# EAGLE schematic weichen-a-1 (EAGLE 9.6.2)
AUTHOR: Balazs Racz; DRAWING_TITLE: MEB Schalterwerk Projekt; LICENSE: Licensed by the Solderpad Hardware License V2.0; REVIEWER: n/a; REVISION: A; YEAR: 2023
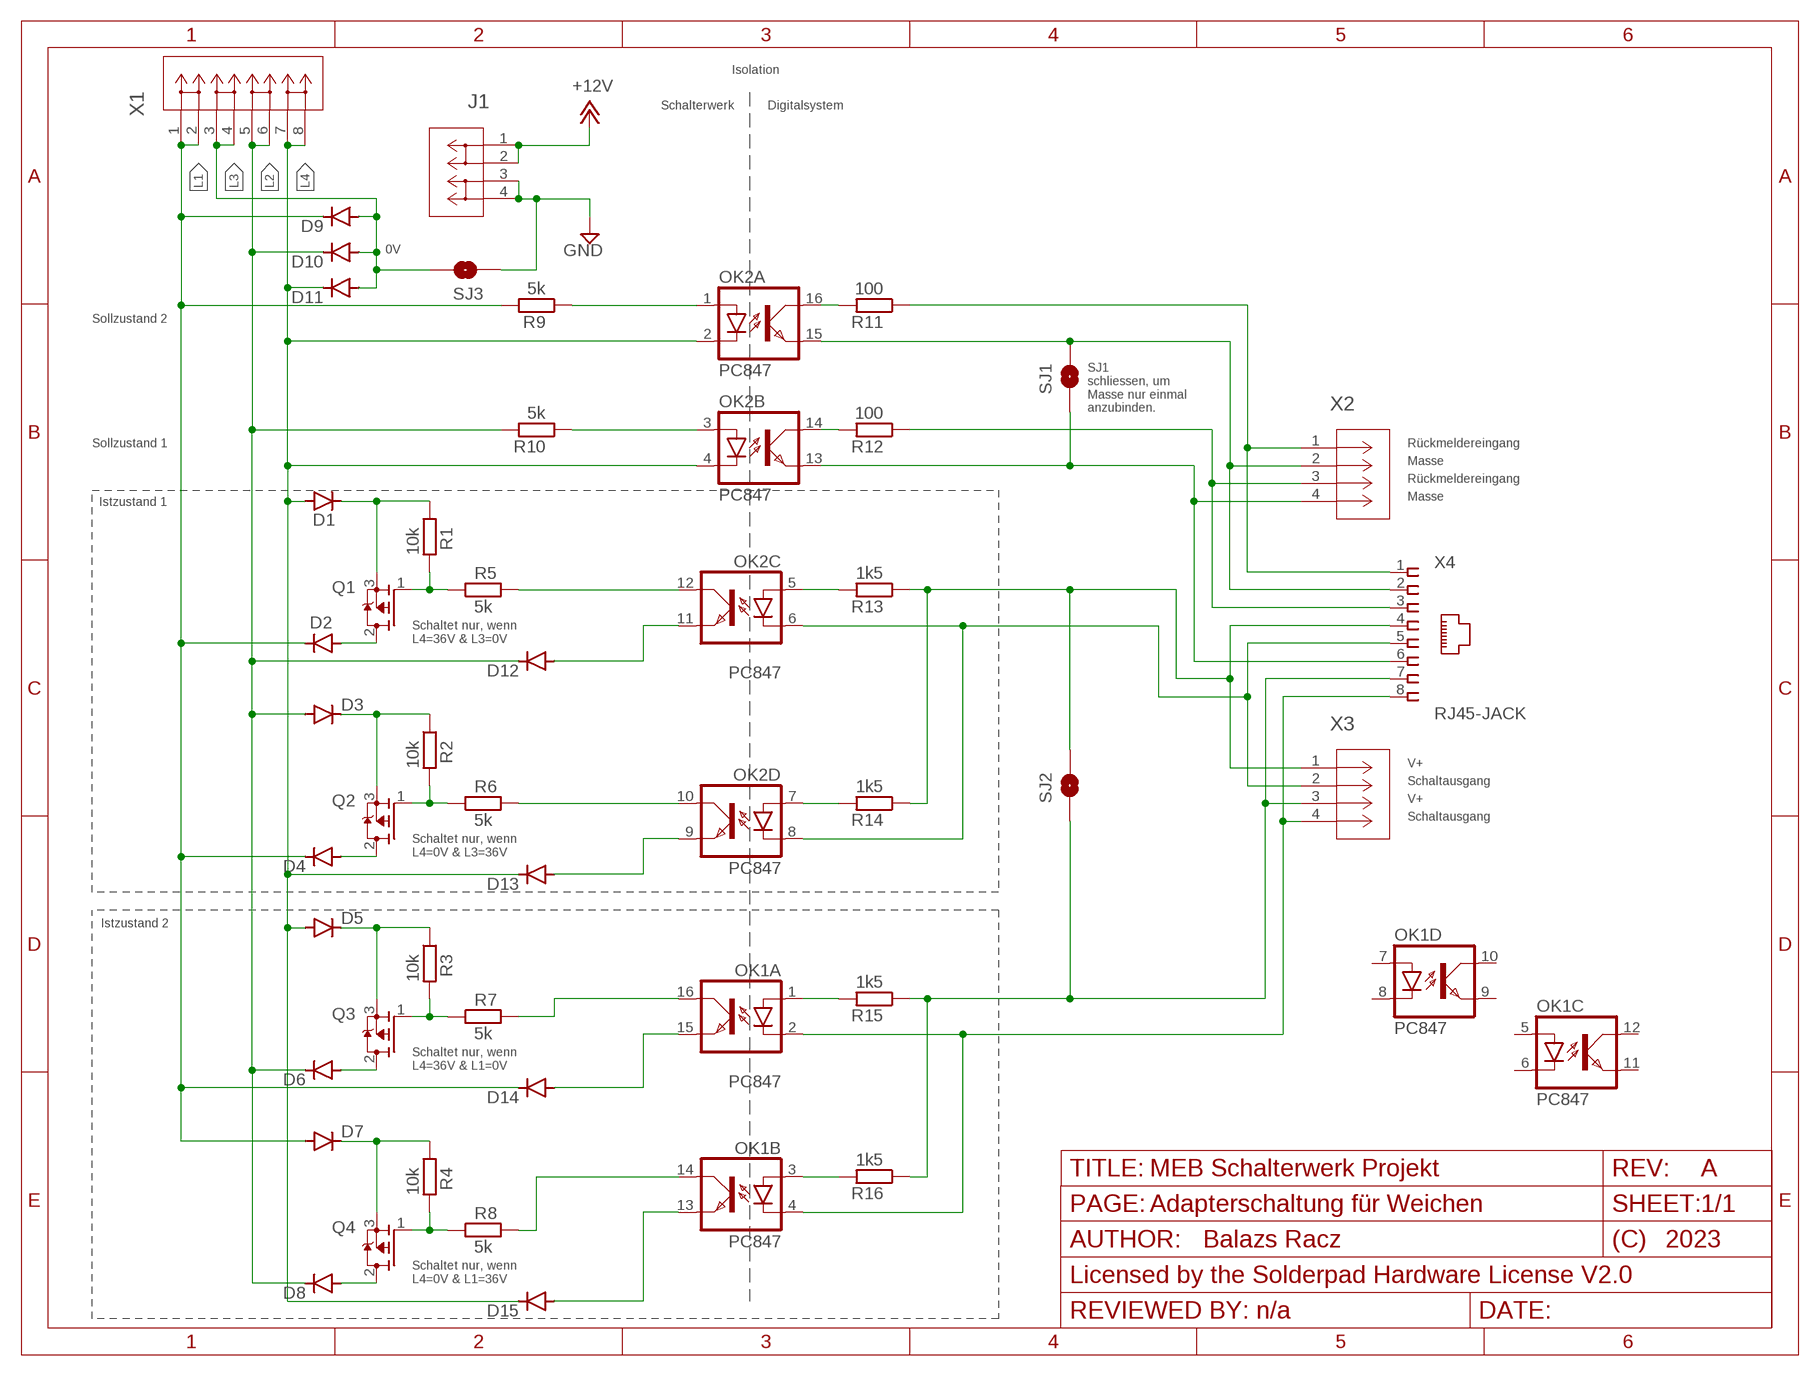
[diagram p0: schematic, sheet 1]
FRAME1 (FRAME_A_L): PAGE: Input ports
FRAME2 (FRAME_A_L): PAGE: Adapterschaltung für Weichen

## Parts
D1  DIODE-DO214AC  [DO214AC]
D2  DIODE-DO214AC  [DO214AC]
D3  DIODE-DO214AC  [DO214AC]
D4  DIODE-DO214AC  [DO214AC]
D5  DIODE-DO214AC  [DO214AC]
D6  DIODE-DO214AC  [DO214AC]
D7  DIODE-DO214AC  [DO214AC]
D8  DIODE-DO214AC  [DO214AC]
D9  DIODE-DO214AC  [DO214AC]
D10  DIODE-DO214AC  [DO214AC]
D11  DIODE-DO214AC  [DO214AC]
D12  DIODE-DO214AC  [DO214AC]
D13  DIODE-DO214AC  [DO214AC]
D14  DIODE-DO214AC  [DO214AC]
D15  DIODE-DO214AC  [DO214AC]
J1  PHNX_2P_508CONN_1017491  [PHNX_2P_508]
OK1  PC847  [DIL16]
OK2  PC847  [DIL16]
Q1  P-MOSFET  [DPAK-2]
Q2  P-MOSFET  [DPAK-2]
Q3  P-MOSFET  [DPAK-2]
Q4  P-MOSFET  [DPAK-2]
R1  10k  R-EU_R0805  [R0805]
R2  10k  R-EU_R0805  [R0805]
R3  10k  R-EU_R0805  [R0805]
R4  10k  R-EU_R0805  [R0805]
R5  5k  R-EU_R0805  [R0805]
R6  5k  R-EU_R0805  [R0805]
R7  5k  R-EU_R0805  [R0805]
R8  5k  R-EU_R0805  [R0805]
R9  5k  R-EU_R0805  [R0805]
R10  5k  R-EU_R0805  [R0805]
R11  100  R-EU_R0805  [R0805]
R12  100  R-EU_R0805  [R0805]
R13  1k5  R-EU_R0805  [R0805]
R14  1k5  R-EU_R0805  [R0805]
R15  1k5  R-EU_R0805  [R0805]
R16  1k5  R-EU_R0805  [R0805]
SJ1  SJRND2  [SJ_RND2]
SJ2  SJRND2  [SJ_RND2]
SJ3  SJRND2  [SJ_RND2]
X1  PHNX_4P_508CONN_1017493  [PHNX_4P_508]
X2  PHNX_4P_350CONN_1984989_PXC  [PHNX_4P_350]
X3  PHNX_4P_350CONN_1984989_PXC  [PHNX_4P_350]
X4  RJ45-JACK  RJ45-JACKRJ45-PULSE-E5J00  [RJ45-PULSE-E5J88]

## Nets
+12V: J1.1 J1.2
GND: J1.3 J1.4 SJ3.P$1
L1: D2.C D4.C D7.A D9.C D14.C R9.2 X1.1 X1.2
L2: D3.A D6.C D8.C D10.C D12.C R10.2 X1.5 X1.6
L3: D9.A D10.A D11.A SJ3.P$2 X1.3 X1.4
L4: D1.A D5.A D11.C D13.C D15.C OK2.2(A:C) OK2.4(B:C) X1.7 X1.8
N$1: D3.C Q2.3(S) R2.1
N$2: OK2.1(A:A) R9.1
N$3: R11.1 X2.1 X4.1
N$4: OK2.15(A:EMIT) SJ1.P$2 X2.2 X4.2
N$5: OK2.5(C:A) R13.2
N$6: R12.1 X2.3 X4.3
N$7: OK2.3(B:A) R10.1
N$8: OK2.7(D:A) R14.2
N$9: Q1.1(G) R1.2 R5.1
N$10: OK2.12(C:COL) R5.2
N$11: OK2.10(D:COL) R6.2
N$12: Q2.1(G) R2.2 R6.1
N$13: D1.C Q1.3(S) R1.1
N$14: OK2.6(C:C) OK2.8(D:C) X3.2 X4.5
N$15: R15.1 R16.1 SJ2.P$1 X3.3 X4.7
N$16: OK1.2(A:C) OK1.4(B:C) X3.4 X4.8
N$17: D12.A OK2.11(C:EMIT)
N$18: D2.A Q1.2(D)
N$19: OK2.16(A:COL) R11.2
N$20: OK2.13(B:EMIT) SJ1.P$1 X2.4 X4.6
N$21: OK2.14(B:COL) R12.2
N$22: D13.A OK2.9(D:EMIT)
N$23: D4.A Q2.2(D)
N$24: OK1.1(A:A) R15.2
N$25: OK1.3(B:A) R16.2
N$26: R13.1 R14.1 SJ2.P$2 X3.1 X4.4
N$27: OK1.16(A:COL) R7.2
N$29: Q3.1(G) R3.2 R7.1
N$30: OK1.14(B:COL) R8.2
N$31: Q4.1(G) R4.2 R8.1
N$33: D7.C Q4.3(S) R4.1
N$34: D5.C Q3.3(S) R3.1
N$35: D14.A OK1.15(A:EMIT)
N$36: D6.A Q3.2(D)
N$37: D15.A OK1.13(B:EMIT)
N$38: D8.A Q4.2(D)
Unconnected: OK1.5(C:A) OK1.6(C:C) OK1.7(D:A) OK1.8(D:C) OK1.9(D:EMIT) OK1.10(D:COL) OK1.11(C:EMIT) OK1.12(C:COL)

## Notes on the sheet
- Isolation
- Schalterwerk | Digitalsystem
- 0V
- Sollzustand 2
- SJ1
  schliessen, um
  Masse nur einmal
  anzubinden.
- Sollzustand 1 | Rückmeldereingang
- Masse
- Rückmeldereingang
- Masse
- Istzustand 1
- Schaltet nur, wenn
  L4=36V & L3=0V
- V+
- Schaltausgang
- V+
- Schaltausgang
- Schaltet nur, wenn
  L4=0V & L3=36V
- Istzustand 2
- Schaltet nur, wenn
  L4=36V & L1=0V
- Schaltet nur, wenn
  L4=0V & L1=36V

## Library data of the parts
D1-D15 = diode:DIODE-: DIODE
J1 = eagleparts:PHNX_2P_508; COPYRIGHT: Copyright (C) 2023 Ultra Librarian. All rights reserved.; MANUFACTURER_PART_NUMBER: 1017503; MFR_NAME: Phoenix Contact
OK1 OK2 = optocoupler:PC847: SHARP OPTO COUPLER; OC_FARNELL: 9707735; OC_NEWARK: unknown
Q1-Q4 = eagleparts:P-MOSFET: RoHS Compliant | Low RDS(on) | Industry-leading quality | Dynamic dv/dt Rating | Fast Switching | Fully Avalanche Rated | 175C Operating Temperature | P-Channel MOSFET; MANUFACTURER: Infineon; MAXIMUM_PACKAGE_HEIGHT: 2.39 mm; PARTREV: 12/14/04; STANDARD: IPC-7351B
R1-R16 = rcl:R-EU_: RESISTOR, European symbol; SPICEPREFIX: R
SJ1-SJ3 = eagleparts:SJ: SMD solder JUMPER
X1 = eagleparts:PHNX_4P_508: https://www.digikey.com/en/products/detail/phoenix-contact/1017505/9346606 DigiKey 277-17516-ND; COPYRIGHT: Copyright (C) 2023 Ultra Librarian. All rights reserved.; MANUFACTURER_PART_NUMBER: 1017505; MFR_NAME: Phoenix Contact
X2 X3 = eagleparts:PHNX_4P_350: https://www.digikey.com/en/products/detail/phoenix-contact/1984989/2513979 DigiKey 277-6404-ND; COPYRIGHT: Copyright (C) 2023 Ultra Librarian. All rights reserved.; MANUFACTURER_PART_NUMBER: 1984989; MFR_NAME: Phoenix Contact
X4 = trainlib:RJ45-JACK: Mod. Jack, Right Angle, 8 posiotion, 8 contatcs RJ45 Source: GLX-S-88M.pdf